# Altium schematic sheet wireframe_sch.SchDoc
size A3; PageSetup: Record=PageOptions|CenterHorizontal=True|CenterVertical=True|PrintScale=0.70|XCorrection=1.00|YCorrection=1.00|PrintKind=0|BorderSize=5000000|LeftOffset=0|BottomOffset=0|Orientation=2|PaperLength=1000|PaperWidth=1000|Scale=100|PaperSource=7|PrintQuality=-4|MediaType=1|DitherType=10|PaperKind=A4|PrintScaleMode=0
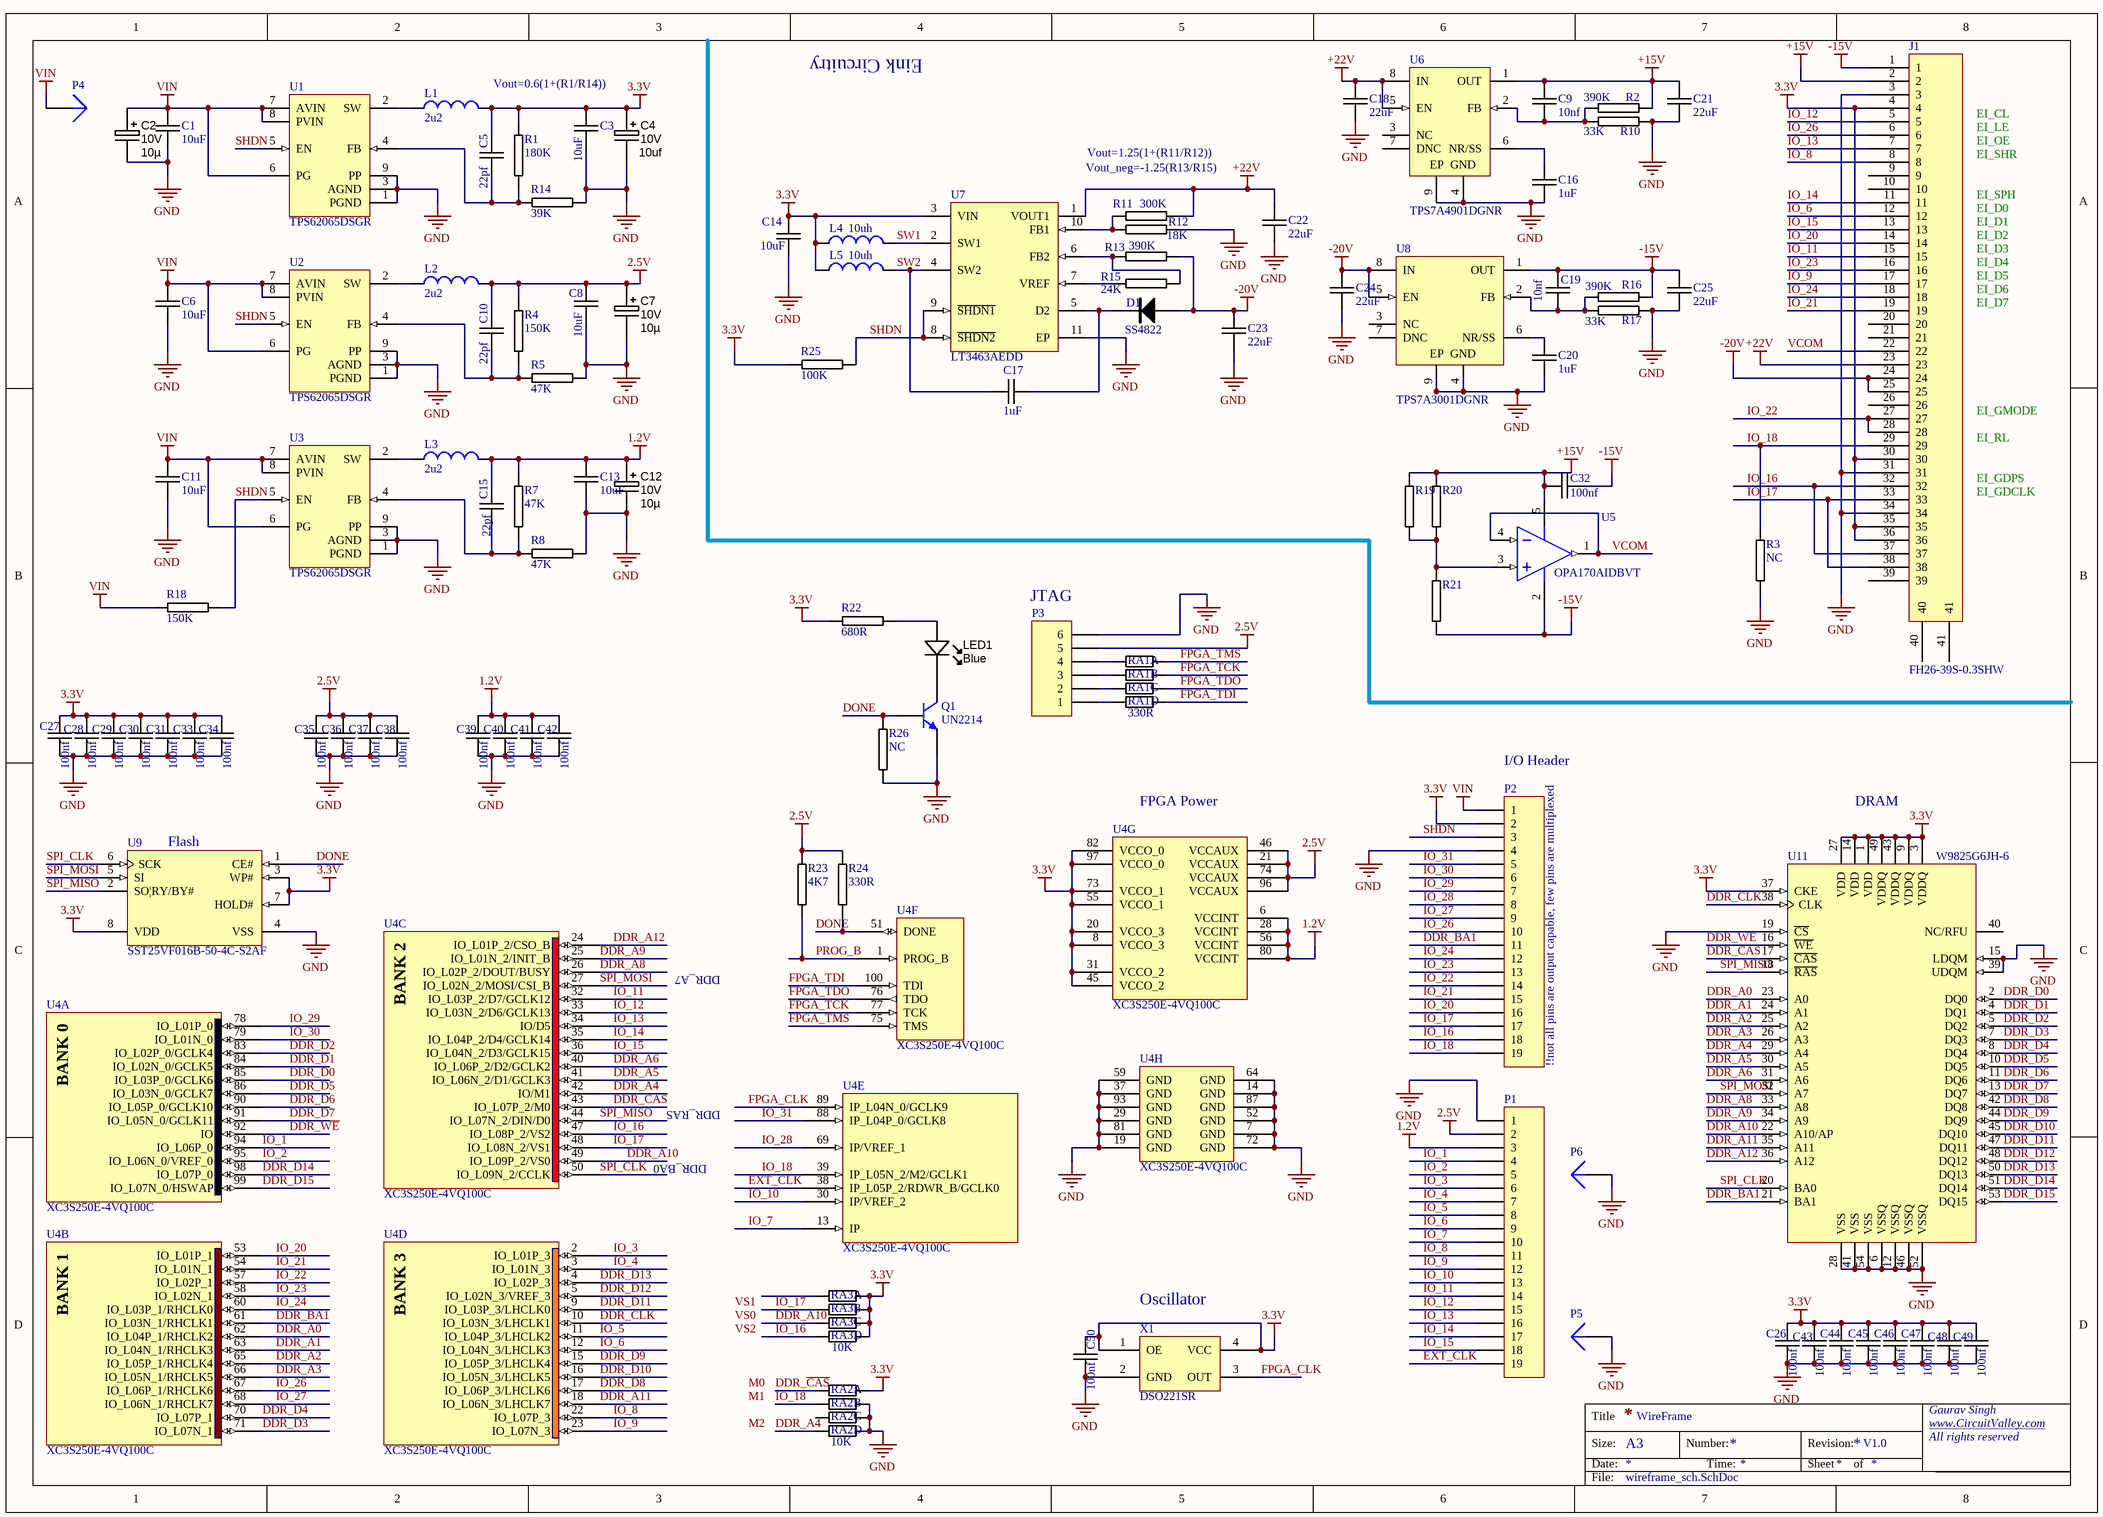
[diagram p0: wireframe_sch.SchDoc]

## Parts
C1  10uF  [0603C-GENERIC]
C2  Ratings: 10V  [CAPMP3528X210N]  (hidden comment: 10µ)
C3  10uF  [0603C-GENERIC]
C4  10uf  Ratings: 10V  [CAPMP3528X210N]
C5  22pf  [0603C-GENERIC]
C6  10uF  [0603C-GENERIC]
C7  Ratings: 10V  [CAPMP3528X210N]  (hidden comment: 10µ)
C8  10uF  [0603C-GENERIC]
C9  10nf  [0603C-GENERIC]
C10  22pf  [0603C-GENERIC]
C11  10uF  [0603C-GENERIC]
C12  Ratings: 10V  [CAPMP3528X210N]  (hidden comment: 10µ)
C13  10uF  [0603C-GENERIC]
C14  10uF  [0603C-GENERIC]
C15  22pf  [0603C-GENERIC]
C16  1uF  [0603C-GENERIC]
C17  1uF  [0603C-GENERIC]
C18  22uF  [0603C-GENERIC]
C19  10nf  [0603C-GENERIC]
C20  1uF  [0603C-GENERIC]
C21  22uF  [0603C-GENERIC]
C22  22uF  [0603C-GENERIC]
C23  22uF  [0603C-GENERIC]
C24  22uF  [0603C-GENERIC]
C25  22uF  [0603C-GENERIC]
C26  100nf  [0603C-GENERIC]
C27  100nf  [0603C-GENERIC]
C28  100nf  [0603C-GENERIC]
C29  100nf  [0603C-GENERIC]
C30  100nf  [0603C-GENERIC]
C31  100nf  [0603C-GENERIC]
C32  100nf  [0603C-GENERIC]
C33  100nf  [0603C-GENERIC]
C34  100nf  [0603C-GENERIC]
C35  100nf  [0603C-GENERIC]
C36  100nf  [0603C-GENERIC]
C37  100nf  [0603C-GENERIC]
C38  100nf  [0603C-GENERIC]
C39  100nf  [0603C-GENERIC]
C40  100nf  [0603C-GENERIC]
C41  100nf  [0603C-GENERIC]
C42  100nf  [0603C-GENERIC]
C43  100nf  [0603C-GENERIC]
C44  100nf  [0603C-GENERIC]
C45  100nf  [0603C-GENERIC]
C46  100nf  [0603C-GENERIC]
C47  100nf  [0603C-GENERIC]
C48  100nf  [0603C-GENERIC]
C49  100nf  [0603C-GENERIC]
C50  100nf  [0603C-GENERIC]
D1  SS4822  [DIODE-SMA]
J1  FH26-39S-0.3SHW  [FH26-39S-0.3SHW]
L1  2u2  [TAIYO_NRS4018T2R2MDGJ]
L2  2u2  [TAIYO_NRS4018T2R2MDGJ]
L3  2u2  [TAIYO_NRS4018T2R2MDGJ]
L4  10uh  [IFSC-1515AH-01]
L5  10uh  [IFSC-1515AH-01]
LED1  Blue  [LED-0805-K]
P1  Header 19  [HDR1X19]  (value not drawn)
P2  Header 19  [HDR1X19]  (value not drawn)
P3  Header 6  [HDR1X6]  (value not drawn)
P4  Plug  [PIN1]  (value not drawn)
P5  Plug  [PIN1]  (value not drawn)
P6  Plug  [PIN1]  (value not drawn)
Q1  UN2214  [SOT23_N]
R1  180K  [0603R-2K2]
R2  390K  [0603R-2K2]
R3  NC  [0402R-GENERIC]
R4  150K  [0603R-2K2]
R5  47K  [0603R-2K2]
R7  47K  [0603R-2K2]
R8  47K  [0603R-2K2]
R10  33K  [0603R-2K2]
R11  300K  [0603R-2K2]
R12  18K  [0603R-2K2]
R13  390K  [0603R-2K2]
R14  39K  [0603R-2K2]
R15  24K  [0603R-2K2]
R16  390K  [0603R-2K2]
R17  33K  [0603R-2K2]
R18  150K  [0603R-2K2]
R19  unknown  [0603R-2K2]  (value not drawn)
R20  unknown  [0603R-2K2]  (value not drawn)
R21  unknown  [0603R-2K2]  (value not drawn)
R22  680R  [0603R-2K2]
R23  4K7  [0603R-2K2]
R24  330R  [0603R-2K2]
R25  100K  [0603R-2K2]
R26  NC  [0402R-GENERIC]
RA1  Thick Film  [EXV28V]  (value not drawn)  (parts A,B,C,D of 4)
RA2  10K  [EXV28V]  (parts A,B,C,D of 4)
RA3  Thick Film  [EXV28V]  (value not drawn)  (parts A,B,C,D of 4)
U1  TPS62065DSGR  [DSG8-1600X900TP]
U2  TPS62065DSGR  [DSG8-1600X900TP]
U3  TPS62065DSGR  [DSG8-1600X900TP]
U4  XC3S250E-4VQ100C  [VQ100_N]  (parts A,B,C,D,E,F,G,H of 8)
U5  OPA170AIDBVT  [TI-DBV5_N]
U6  TPS7A4901DGNR  [TI-DGN8-1760X1425TP_N]
U7  LT3463AEDD  [LT-DD-10_V]
U8  TPS7A3001DGNR  [TI-DGN8-1760X1425TP_N]
U9  SST25VF016B-50-4C-S2AF  [MCHP-SOIC-S2A8_N]
U11  W9825G6JH-6  [54_TSOP2_400AF_N]
X1  DSO221SR  [Active Oscillator 2520]

## Nets
1.2V: C12.1 C13.2 C15.2 C39.2 C40.2 C41.2 C42.2 L3.2 P1.3 R7.2 U4.6(VCCINT) U4.28(VCCINT) U4.56(VCCINT) U4.80(VCCINT)
2.5V: C7.1 C8.2 C10.2 C35.2 C36.2 C37.2 C38.2 L2.2 P1.2 P3.5 R4.2 R23.2 R24.2 U4.21(VCCAUX) U4.46(VCCAUX) U4.74(VCCAUX) U4.96(VCCAUX)
3.3V: C3.2 C4.1 C5.2 C14.2 C26.2 C27.2 C28.2 C29.2 C30.2 C31.2 C33.2 C34.2 C43.2 C44.2 C45.2 C46.2 C47.2 C48.2 C49.2 C50.2 J1.4 J1.30 J1.35 J1.36 L1.2 L4.1 L5.1 P2.2 R1.2 R22.2 R25.2 RA2.1 RA3.1 RA3.2 RA3.3 RA3.4 U4.8(VCCO_3) U4.20(VCCO_3) U4.31(VCCO_2) U4.45(VCCO_2) U4.55(VCCO_1) U4.73(VCCO_1) U4.82(VCCO_0) U4.97(VCCO_0) U7.3(VIN) U9.3(WP#) U9.7(HOLD#) U9.8(VDD) U11.1(VDD) U11.3(VDDQ) U11.9(VDDQ) U11.14(VDD) U11.27(VDD) U11.37(CKE) U11.43(VDDQ) U11.49(VDDQ) X1.1(OE) X1.4(VCC)
+15V: C9.1 C21.2 C32.2 J1.2 R2.2 R19.2 R20.2 U5.5(V+) U6.1(OUT)
+22V: C18.2 C22.2 J1.23 R11.2 U6.5(EN) U6.8(IN) U7.1(VOUT1)
-15V: C19.1 C25.2 C32.1 J1.1 R16.2 R21.1 U5.2(V-) U8.1(OUT)
-20V: C23.2 C24.2 D1.A J1.24 J1.25 R13.2 U8.5(EN) U8.8(IN)
GND: C1.1 C2.2 C3.1 C4.2 C6.1 C7.2 C8.1 C11.1 C12.2 C13.1 C14.1 C16.1 C18.1 C20.2 C21.1 C22.1 C23.1 C24.1 C25.1 C26.1 C27.1 C28.1 C29.1 C30.1 C31.1 C33.1 C34.1 C35.1 C36.1 C37.1 C38.1 C39.1 C40.1 C41.1 C42.1 C43.1 C44.1 C45.1 C46.1 C47.1 C48.1 C49.1 C50.1 J1.3 J1.31 J1.34 P1.1 P2.4 P3.6 P5.1 P6.1 Q1.2(E) R3.2 R5.1 R8.1 R10.2 R12.1 R14.1 R17.2 R26.2 RA2.2 RA2.3 RA2.4 U1.1(PGND) U1.3(AGND) U1.9(PP) U2.1(PGND) U2.3(AGND) U2.9(PP) U3.1(PGND) U3.3(AGND) U3.9(PP) U4.7(GND) U4.14(GND) U4.19(GND) U4.29(GND) U4.37(GND) U4.52(GND) U4.59(GND) U4.64(GND) U4.72(GND) U4.81(GND) U4.87(GND) U4.93(GND) U6.4(GND) U6.9(EP) U7.11(EP) U8.4(GND) U8.9(EP) U9.4(VSS) U11.6(VSSQ) U11.12(VSSQ) U11.15(LDQM) U11.19(~{CS}) U11.28(VSS) U11.39(UDQM) U11.41(VSS) U11.46(VSSQ) U11.52(VSSQ) U11.54(VSS) X1.2(GND)
VIN: C1.2 C2.1 C6.2 C11.2 P2.1 P4.1 R18.2 U1.6(PG) U1.7(AVIN) U1.8(PVIN) U2.6(PG) U2.7(AVIN) U2.8(PVIN) U3.6(PG) U3.7(AVIN) U3.8(PVIN)
DDR_A0: U4.62(IO_L04P_1/RHCLK2) U11.23(A0)
DDR_A1: U4.63(IO_L04N_1/RHCLK3) U11.24(A1)
DDR_A2: U4.65(IO_L05P_1/RHCLK4) U11.25(A2)
DDR_A3: U4.66(IO_L05N_1/RHCLK5) U11.26(A3)
DDR_A4: RA2.5 U4.42(IO/M1) U11.29(A4)
DDR_A5: U4.41(IO_L06N_2/D1/GCLK3) U11.30(A5)
DDR_A6: U4.40(IO_L06P_2/D2/GCLK2) U11.31(A6)
DDR_A8: U4.26(IO_L02P_2/DOUT/BUSY) U11.33(A8)
DDR_A9: U4.25(IO_L01N_2/INIT_B) U11.34(A9)
DDR_A10: RA3.6 U4.49(IO_L09P_2/VS0) U11.22(A10/AP)
DDR_A11: U4.18(IO_L06N_3/LHCLK7) U11.35(A11)
DDR_A12: U4.24(IO_L01P_2/CSO_B) U11.36(A12)
DDR_BA1: P2.11 U4.61(IO_L03N_1/RHCLK1) U11.21(BA1)
DDR_~{CAS}: RA2.8 U4.43(IO_L07P_2/M0) U11.17(~{CAS})
DDR_CLK: U4.10(IO_L03N_3/LHCLK1) U11.38(CLK)
DDR_D0: U4.85(IO_L03P_0/GCLK6) U11.2(DQ0)
DDR_D1: U4.84(IO_L02N_0/GCLK5) U11.4(DQ1)
DDR_D2: U4.83(IO_L02P_0/GCLK4) U11.5(DQ2)
DDR_D3: U4.71(IO_L07N_1) U11.7(DQ3)
DDR_D4: U4.70(IO_L07P_1) U11.8(DQ4)
DDR_D5: U4.86(IO_L03N_0/GCLK7) U11.10(DQ5)
DDR_D6: U4.90(IO_L05P_0/GCLK10) U11.11(DQ6)
DDR_D7: U4.91(IO_L05N_0/GCLK11) U11.13(DQ7)
DDR_D8: U4.17(IO_L06P_3/LHCLK6) U11.42(DQ8)
DDR_D9: U4.15(IO_L05P_3/LHCLK4) U11.44(DQ9)
DDR_D10: U4.16(IO_L05N_3/LHCLK5) U11.45(DQ10)
DDR_D11: U4.9(IO_L03P_3/LHCLK0) U11.47(DQ11)
DDR_D12: U4.5(IO_L02N_3/VREF_3) U11.48(DQ12)
DDR_D13: U4.4(IO_L02P_3) U11.50(DQ13)
DDR_D14: U4.98(IO_L07P_0) U11.51(DQ14)
DDR_D15: U4.99(IO_L07N_0/HSWAP) U11.53(DQ15)
DDR_~{WE}: U4.92(IO) U11.16(~{WE})
DONE: Q1.1(B) R24.1 R26.1 U4.51(DONE) U9.1(CE#)
EXT_CLK: P1.19 U4.38(IP_L05P_2/RDWR_B/GCLK0)
FPGA_CLK: U4.89(IP_L04N_0/GCLK9) X1.3(OUT)
FPGA_TCK: RA1.2 U4.77(TCK)
FPGA_TDI: RA1.4 U4.100(TDI)
FPGA_TDO: RA1.3 U4.76(TDO)
FPGA_TMS: RA1.1 U4.75(TMS)
IO_1: P1.4 U4.94(IO_L06P_0)
IO_2: P1.5 U4.95(IO_L06N_0/VREF_0)
IO_3: P1.6 U4.2(IO_L01P_3)
IO_4: P1.7 U4.3(IO_L01N_3)
IO_5: P1.8 U4.11(IO_L04P_3/LHCLK2)
IO_6: J1.12 P1.9 U4.12(IO_L04N_3/LHCLK3)
IO_7: P1.10 U4.13(IP)
IO_8: J1.8 P1.11 U4.22(IO_L07P_3)
IO_9: J1.17 P1.12 U4.23(IO_L07N_3)
IO_10: P1.13 U4.30(IP/VREF_2)
IO_11: J1.15 P1.14 U4.32(IO_L03P_2/D7/GCLK12)
IO_12: J1.5 P1.15 U4.33(IO_L03N_2/D6/GCLK13)
IO_13: J1.7 P1.16 U4.34(IO/D5)
IO_14: J1.11 P1.17 U4.35(IO_L04P_2/D4/GCLK14)
IO_15: J1.13 P1.18 U4.36(IO_L04N_2/D3/GCLK15)
IO_16: J1.32 J1.37 P2.18 RA3.5 U4.47(IO_L08P_2/VS2)
IO_17: J1.33 J1.38 P2.17 RA3.7 U4.48(IO_L08N_2/VS1)
IO_18: J1.29 P2.19 R3.1 RA2.7 U4.39(IP_L05N_2/M2/GCLK1)
IO_20: J1.14 P2.16 U4.53(IO_L01P_1)
IO_21: J1.19 P2.15 U4.54(IO_L01N_1)
IO_22: J1.27 J1.28 P2.14 U4.57(IO_L02P_1)
IO_23: J1.16 P2.13 U4.58(IO_L02N_1)
IO_24: J1.18 P2.12 U4.60(IO_L03P_1/RHCLK0)
IO_26: J1.6 P2.10 U4.67(IO_L06P_1/RHCLK6)
IO_27: P2.9 U4.68(IO_L06N_1/RHCLK7)
IO_28: P2.8 U4.69(IP/VREF_1)
IO_29: P2.7 U4.78(IO_L01P_0)
IO_30: P2.6 U4.79(IO_L01N_0)
IO_31: P2.5 U4.88(IP_L04P_0/GCLK8)
PROG_B: R23.1 U4.1(PROG_B)
SHDN: P2.3 R18.1 R25.1 U1.5(EN) U2.5(EN) U3.5(EN) U7.8(~{SHDN2}) U7.9(~{SHDN1})
SPI_CLK: U4.50(IO_L09N_2/CCLK) U9.6(SCK) U11.20(BA0)
SPI_MISO: U4.44(IO_L07N_2/DIN/D0) U9.2(SO|RY/BY#) U11.18(~{RAS})
SPI_MOSI: U4.27(IO_L02N_2/MOSI/CSI_B) U9.5(SI) U11.32(A7)
SW1: L4.2 U7.2(SW1)
SW2: C17.2 L5.2 U7.4(SW2)
VCOM: J1.22 U5.1(OUT) U5.4(IN-)
NetC5_1: C5.1 R1.1 R14.2 U1.4(FB)
NetC9_2: C9.2 R2.1 R10.1 U6.2(FB)
NetC10_1: C10.1 R4.1 R5.2 U2.4(FB)
NetC15_1: C15.1 R7.1 R8.2 U3.4(FB)
NetC16_2: C16.2 U6.6(NR/SS)
NetC17_1: C17.1 D1.K U7.5(D2)
NetC19_2: C19.2 R16.1 R17.1 U8.2(FB)
NetC20_1: C20.1 U8.6(NR/SS)
NetL1_1: L1.1 U1.2(SW)
NetL2_1: L2.1 U2.2(SW)
NetL3_1: L3.1 U3.2(SW)
NetLED1_A: LED1.A R22.1
NetLED1_K: LED1.K Q1.3(C)
NetP3_1: P3.1 RA1.5
NetP3_2: P3.2 RA1.6
NetP3_3: P3.3 RA1.7
NetP3_4: P3.4 RA1.8
NetR11_1: R11.1 R12.2 U7.10(FB1)
NetR13_1: R13.1 R15.2 U7.6(FB2)
NetR15_1: R15.1 U7.7(VREF)
NetR19_1: R19.1 R20.1 R21.2 U5.3(IN+)

Not connected (* = marked no-connect by the designer): J1 9 10 20 21 26 39 40 41; RA2 6; RA3 8; U6 3(NC) 7(DNC); U8 3(NC) 7(DNC); U11 40(NC/RFU)

## Notes on the sheet
- Eink Circuitry
- Vout=0.6(1+(R1/R14))
- Vout_neg=-1.25(R13/R15)
- Vout=1.25(1+(R11/R12))
- (near P3) JTAG
- (near P2) I/O Header
- (near U9) Flash
- (near U4) FPGA Power
- DRAM
- DDR_A7
- (near P2) !!not all pins are output capable, few pins are multiplexed
- DDR_RAS
- DDR_BA0
- (near X1) Oscillator
- WireFrame
- V1.0
- Labels drawn without touching a wire or pin: EI_CL, EI_D0, EI_D1, EI_D2, EI_D3, EI_D4, EI_D5, EI_D6, EI_D7, EI_GDCLK, EI_GDPS, EI_GMODE, EI_LE, EI_OE, EI_RL, EI_SHR, EI_SPH, M0, M1, M2, VS0, VS1, VS2
- Title
- Size:
- Date:
- A3
- Number:
- Time:
- Revision:
- Sheet
- of
- Gaurav Singh
- www.CircuitValley.com
- All rights reserved
- File:
- (in symbol XC3S250E-4VQ100C, part A) BANK 0
- (in symbol XC3S250E-4VQ100C, part B) BANK 1
- (in symbol XC3S250E-4VQ100C, part C) BANK 2
- (in symbol XC3S250E-4VQ100C, part D) BANK 3

## Library data of the parts
C1 C3 C5 C6 C8-C11 C13-C50 = 0603C-10UF-6V3-X5R-MUR: CAPACITOR 0603 CERAMIC; Manufacturer: Murata Electronics North America; Manufacturer Part Number: GRM188R60J106ME47D; Reel: C24; Supplier 1: Digi-Key; Supplier Part Number 1: 490-3896-2-ND
C2 C12 = CAPT_47u_1210_6V3: Capacitor SMD Tantalum 47uF 20% 6.3V 1210; Manufacturer 1: AVX Corporation; Manufacturer Part Number 1: TCJB476M006R0070; Manufacturer Size Code: B; ESR (Equivalent Series Resistance): 70.0 mOhm; Type: Molded; Package / Case: 1210 (3528 Metric); Tolerance: ±20%; Material: Tantalum; Supplier 1: Digi-Key; Supplier Part Number 1: 478-3139-1-ND; Voltage - Rated: 10V; Operating Temperature: -55°C ~ 125°C; Size / Dimension: 0.138" L x 0.110" W (3.50mm x 2.80mm); Height - Seated (Max): 0.083" (2.10mm); ComponentLink1URL: http://www.avx.com/docs/Catalogs/tcj.pdf; ComponentLink1Description: http://www.avx.com/docs/Catalogs/tcj.pdf; Value: 10µ
C4 = CAPT_47u_1210_6V3: Capacitor SMD Tantalum 47uF 20% 6.3V 1210; Manufacturer 1: AVX Corporation; Manufacturer Part Number 1: TCJB476M006R0070; Manufacturer Size Code: B; ESR (Equivalent Series Resistance): 70.0 mOhm; Type: Molded; Value: 47µ; Package / Case: 1210 (3528 Metric); Tolerance: ±20%; Material: Tantalum; Supplier 1: Digi-Key; Supplier Part Number 1: 478-3139-1-ND; Voltage - Rated: 10V; Operating Temperature: -55°C ~ 125°C; Size / Dimension: 0.138" L x 0.110" W (3.50mm x 2.80mm); Height - Seated (Max): 0.083" (2.10mm); ComponentLink1URL: http://www.avx.com/docs/Catalogs/tcj.pdf; ComponentLink1Description: http://www.avx.com/docs/Catalogs/tcj.pdf
C7 = CAPT_47u_1210_6V3: Capacitor SMD Tantalum 47uF 20% 6.3V 1210; Manufacturer 1: AVX Corporation; Manufacturer Part Number 1: TCJB476M006R0070; Manufacturer Size Code: B; Voltage - Rated: 6V3; ESR (Equivalent Series Resistance): 70.0 mOhm; Type: Molded; Package / Case: 1210 (3528 Metric); Tolerance: ±20%; Material: Tantalum; Supplier 1: Digi-Key; Supplier Part Number 1: 478-3139-1-ND; Operating Temperature: -55°C ~ 125°C; Size / Dimension: 0.138" L x 0.110" W (3.50mm x 2.80mm); Height - Seated (Max): 0.083" (2.10mm); ComponentLink1URL: http://www.avx.com/docs/Catalogs/tcj.pdf; ComponentLink1Description: http://www.avx.com/docs/Catalogs/tcj.pdf; Value: 10µ
D1 = MBRS140: DIODE; Supplier 1: Digi-Key; Supplier Part Number 1: MBRS140FSTR-ND
L1-L3 = inductor_smd: PartNumber: NRS4018T2R2MDGJ
L4 L5 = inductor_smd: PartNumber: IFSC1515AHER100M01
LED1 = LED_SMD_Blue_0805_100mcd: LED 0805 SMD Blue 100mcd 470nm; Manufacturer 1: Ligitek; Manufacturer Part Number 1: LG-170DBKZ-CT; Material: InGaN/GaN; Ratings: 100 mcd; 470 nm; Package / Case: 0805; Value: Blue; Color: Blue
P1 P2 = Header 19: Header, 19-Pin; LatestRevisionDate: 17-Jul-2002; LatestRevisionNote: Re-released for DXP Platform.; Publisher: Altium Limited
P3 = Header 6: Header, 6-Pin; LatestRevisionDate: 17-Jul-2002; LatestRevisionNote: Re-released for DXP Platform.; Publisher: Altium Limited
Q1 = BC847: NPN General-purpose Transistor; Published: 17-Sep-2003; LatestRevisionDate: 12-Dec-2006; LatestRevisionNote: IPC-7351 Footprint Added.; DatasheetVersion: 4-Feb-2002; PackageVersion: May-1999; PackageReference: SOT23; Publisher: Altium Limited; PackageDescription: 3-Pin SOT-23 Package 0.95 mm Pitch, 2.3 mm Lead Span; ComponentLink1Description: Manufacturer Link; ComponentLink1URL: http://www.semiconductors.philips.com/; ComponentLink2Description: Datasheet; ComponentLink2URL: http://www.semiconductors.philips.com/acrobat/datasheets/BC846_BC847_BC848_5.pdf
R1 R2 R4 R5 R7 R8 R10-R25 = 0603R-2K2: GENERIC RESISTOR 0603; Manufacturer Part Number: RMC 1/16 2.2K 1% R; Manufacturer: Stackpole Electronics Inc; REEL: R88; Supplier 1: Digi-Key; Supplier Part Number 1: RMCF0603FT2K20TR-ND
R3 R26 = 0402R-100R: RESISTOR 0402 GENERIC
RA1-RA3 = RES_ARRAY_0402_5%: Resistor array 4-pack 5% 0402 SMD
U1-U3 = TPS62067DSGR: Buck Step Down Regulator with 2.9 to 6 V Input and 0.8 to 6 V Output, -40 to 85 degC, 8-Pin WSON (DSG), Green (RoHS & no Sb/Br); Manufacturer: Texas Instruments; Duty Cycle(Max)(%): 100; Iout(Max)(A): 2; Iq(Typ)(mA): 0.018; Rating: Catalog; Regulated Outputs(#): 1; SubFamily: Step-Down Regulator; Switch Current Limit(Typ)(A): 2.75; Synchronous Rectification: TRUE; Vin(Max)(V): 6; Vin(Min)(V): 2.9; Vout(Min)(V): 0.8; DatasheetVersion: SLVS833A; PackageVersion: revB, Oct-2010; PackageReference: DSG8-1600X900TP; PackageDescription: 8-Pin Plastic Small Outline No-Lead, 2 x 2 x 0.8 mm Body, 0.5 mm Pitch, Exposed Pad; Supplier 1: Digi-Key; Supplier Part Number 1: TPS62067DSGR-ND; Supplier 2: Newark; Supplier Part Number 2: 72R6655; Supplier 3: Mouser; Supplier Part Number 3: 595-TPS62067DSGR; Eco-Plan: Green (RoHS & no Sb/Br); Topology: Buck; Vout(Max)(V): 6; Mounting Technology: Surface Mount; Code_JEDEC: MO-229; PartNumber: TPS62067DSGR; ComponentLink1Description: Datasheet; ComponentLink1URL: http://www.ti.com/general/docs/lit/getliterature.tsp?genericPartNumber=TPS62067&fileType=pdf; ComponentLink2Description: Package Specification; ComponentLink2URL: http://www.ti.com/litv/pdf/mpds308a; ComponentLink3Description: URL Link1; ComponentLink3URL: Samples URL:http://www.ti.com/product/tps62067#samples
U4 = XC3S250E-4VQ100C: Spartan-3E 1.2V FPGA, 66 User I/Os, 100-Pin VQFP, Standard Performance, Commercial Grade; DatasheetVersion: ver3.8, Aug-2009; PackageVersion: ver1.2.1, Feb-2007; PackageReference: VQ100; PackageDescription: 100-Pin Very Thin Quad Flat Pack (VQ100); Code_JEDEC: MS-026-AED; ComponentLink1Description: Manufacturer URL; ComponentLink1URL: http://www.xilinx.com/; ComponentLink2Description: Spartan-3E Datasheet; ComponentLink2URL: http://www.xilinx.com/support/documentation/data_sheets/ds312.pdf; ComponentLink3Description: VQ100 Package Drawing; ComponentLink3URL: http://www.xilinx.com/support/documentation/package_specs/vq100.pdf; ComponentLink4Description: Spartan-3E Documents; ComponentLink4URL: http://www.xilinx.com/support/documentation/spartan-3e.htm
U5 = OPA244NA/250: MicroPower Single-Supply Operational Amplifier MicroAmplifier(TM) Series, 2.2 to 36 V, -40 to 85 degC, 5-pin SOT23 (DBV5), Green (RoHS & no Sb/Br); Manufacturer: Texas Instruments; CMRR(Min)(dB): 84; GBW(Typ)(MHz): 0.43; IIB(Max)(pA): 25000; Iq per channel(Max)(mA): 0.06; Number of Channels: 1; Offset Drift(Typ)(uV/C): 4; Packing: SMALL T&R; Rating: Catalog; Slew Rate(Typ)(V/us): 0.1; Sub Family: High Supply Voltage Amplifier (>=30V), Low Power Amp (<=500uA), Low Supply Voltage Amplifier (<=2.7V), Precision Amplifier; Total Supply Voltage(Max)(+5V is 5, +/-5V is 10): 36; Total Supply Voltage(Min)(+5V is 5, +/-5V is 10): 2.2; Vio (25C)(Max)(mV): 1.5; DatasheetVersion: SBOS088; PackageVersion: 4073253-4/K, 03/2006; PackageReference: DBV5; PackageDescription: 5-Pin Plastic Small Outline, Body 1.6 x 2.9 mm, Pitch 0.95 mm; Supplier 1: Digi-Key; Supplier Part Number 1: OPA244NATR-ND; Supplier 2: Digi-Key; Supplier Part Number 2: OPA244NACT-ND; Supplier 3: Digi-Key; Supplier Part Number 3: OPA244NADKR-ND; Supplier 4: Farnell; Supplier Part Number 4: 4413477; Supplier 5: Newark; Supplier Part Number 5: 35C1876; Supplier 6: Mouser; Supplier Part Number 6: 595-OPA244NA/250; Eco-Plan: Green (RoHS & no Sb/Br); Mounting Technology: Surface Mount; Code_JEDEC: MO-178; PartNumber: OPA170AIDBVT; ComponentLink1Description: Manufacturer URL; ComponentLink1URL: http://www.ti.com/; ComponentLink2Description: Datasheet; ComponentLink2URL: http://www.ti.com/lit/ds/symlink/opa244.pdf; ComponentLink3Description: Package Specification; ComponentLink3URL: http://www.ti.com/litv/pdf/mpds018i
U6 = TPS7A4901DGNR: Single Output High PSRR LDO, 150 mA, Adjustable 1.2 to 33 V Output, 3 to 36 V Input, with Ultra-Low Noise, 8-pin MSOP (DGN), -40 to 125 degC, Green (RoHS & no Sb/Br); Manufacturer: Texas Instruments; Accuracy(%): 1.5; Iout(Max)(A): 0.15; Iq(Typ)(mA): 0.06; Power Good: TRUE; SubFamily: Single Channel LDO; Vdo(Typ)(mV): 260; Vin(Max)(V): 36; Vin(Min)(V): 3; Vout Adj(Max)(V): 33; Vout Adj(Min)(V): 1.2; DatasheetVersion: SBVS121B; PackageVersion: 4073271/F; PackageReference: DGN8-1760X1425TP; PackageDescription: 8-pin Plastic Small Outline, Body 3 x 3 mm, Pitch 0.65 mm; Supplier 1: Digi-Key; Supplier Part Number 1: 296-27751-2-ND; Supplier 2: Digi-Key; Supplier Part Number 2: 296-27751-1-ND; Supplier 3: Digi-Key; Supplier Part Number 3: 296-27751-6-ND; Supplier 4: Newark; Supplier Part Number 4: 01T0879; Supplier 5: Mouser; Supplier Part Number 5: 595-TPS7A4901DGNR; Eco-Plan: Green (RoHS & no Sb/Br); Mounting Technology: Surface Mount; Code_JEDEC: MO-187; PartNumber: TPS7A4901DGNR; ComponentLink1Description: Manufacturer URL; ComponentLink1URL: http://www.ti.com/; ComponentLink2Description: Datasheet; ComponentLink2URL: http://www.ti.com/general/docs/lit/getliterature.tsp?genericPartNumber=TPS7A4901&fileType=pdf; ComponentLink3Description: Package Specification; ComponentLink3URL: http://www.ti.com/litv/pdf/mpds046e
U7 = LT3463AEDD: Dual Micropower DC/DC Converters with Schottky Diodes, 2.4 to 15 V Vin, 10-pin SON (DD-10), -40 to 85 degC; Manufacturer: Linear Technology; Number of Outputs: 2; Vin Max(V): 15; Vin Min(V): 2.4; PackageVersion: Rev. C, 06/2010; PackageReference: DD-10; PackageDescription: 10-Pin Plastic DFN, Body 3 x 3 mm, Pitch 0.5 mm; Supplier 1: Digi-Key; Supplier Part Number 1: LT3463AEDD-ND; RoHS: FALSE; Mounting Technology: Surface Mount; Code_JEDEC: MO-229; PartNumber: LT3463AEDD; ComponentLink1Description: Manufacturer URL; ComponentLink1URL: http://www.linear.com/; ComponentLink2Description: Datasheet; ComponentLink2URL: http://cds.linear.com/docs/en/datasheet/3463f.pdf; ComponentLink3Description: Package Specification; ComponentLink3URL: http://cds.linear.com/docs/en/packaging/DFN_10_05-08-1699.pdf
U8 = TPS7A3001DGNR: Single Output High PSRR LDO, 200 mA, Adjustable -1.18 to -33 V Output, -3 to -36 V Input, with Ultra-Low Noise, 8-pin MSOP (DGN), -40 to 125 degC, Green (RoHS & no Sb/Br); Manufacturer: Texas Instruments; Accuracy(%): 1.5; Iout(Max)(A): 0.2; Iq(Typ)(mA): 0.05; SubFamily: Single Channel LDO; Vdo(Typ)(mV): 216; DatasheetVersion: SBVS125A; PackageVersion: 4073271/F; PackageReference: DGN8-1760X1425TP; PackageDescription: 8-pin Plastic Small Outline, Body 3 x 3 mm, Pitch 0.65 mm; Supplier 1: Digi-Key; Supplier Part Number 1: 296-27750-2-ND; Supplier 2: Digi-Key; Supplier Part Number 2: 296-27750-1-ND; Supplier 3: Digi-Key; Supplier Part Number 3: 296-27750-6-ND; Supplier 4: Newark; Supplier Part Number 4: 01T0878; Supplier 5: Mouser; Supplier Part Number 5: 595-TPS7A3001DGNR; Eco-Plan: Green (RoHS & no Sb/Br); Vin(Max)(V): -36; Vin(Min)(V): -3; Vout Adj(Max)(V): -33; Vout Adj(Min)(V): -1.18; Mounting Technology: Surface Mount; Code_JEDEC: MO-187; PartNumber: TPS7A3001DGNR; ComponentLink1Description: Manufacturer URL; ComponentLink1URL: http://www.ti.com/; ComponentLink2Description: Datasheet; ComponentLink2URL: http://www.ti.com/general/docs/lit/getliterature.tsp?genericPartNumber=TPS7A3001&fileType=pdf; ComponentLink3Description: Package Specification; ComponentLink3URL: http://www.ti.com/litv/pdf/mpds046e
U9 = SST25VF016B-50-4C-S2AF: 16 Mbit SPI Serial Flash, 2.7 to 3.6 V, 50 MHz, 0 to 70 degC, 8-pin SOIC (S2A8), Tube; Manufacturer: Microchip; DatasheetVersion: Rev. A; PackageVersion: Rev. A; PackageReference: SOIC-S2A8; PackageDescription: 8-Lead Plastic Small Outline Intergrated Circuit, 5.275 x 5.275 mm Body, 1.27 mm Pitch; Supplier 1: Digi-Key; Supplier Part Number 1: SST25VF016B-50-4C-S2AF-ND; Supplier 2: Newark; Supplier Part Number 2: 82R4467; Supplier 3: Mouser; Supplier Part Number 3: 579-25VF016B504CS2AF; Mounting Technology: Surface Mount; PartNumber: SST25VF016B-50-4C-S2AF; ComponentLink1Description: Manufacturer URL; ComponentLink1URL: http://www.microchip.com; ComponentLink2Description: Datasheet; ComponentLink2URL: http://ww1.microchip.com/downloads/en/DeviceDoc/25044A.pdf; ComponentLink3Description: Package Specification; ComponentLink3URL: http://ww1.microchip.com/downloads/en/DeviceDoc/25051A.pdf; ComponentLink4Description: Product URL; ComponentLink4URL: http://www.microchip.com/SST25VF016B
U11 = K4S511632B-TC75: 512Mb Synchronous High Data Rate DRAM, 8Mb x 16Bit x 4 Banks, 54-Pin TSOP; Frequency: 133MHz (max); RowAddress: A0-A12; ColumnAddress: A0-A9; Published: 11-Oct-2004; LatestRevisionDate: 13-Apr-2006; LatestRevisionNote: IPC-7351 Footprint Added.; DatasheetVersion: rev1.1, Feb-2004; PackageVersion: Aug-2004; PackageReference: 54_TSOP2_400AF; Publisher: Altium Limited; PackageDescription: 54-Pin Small Outline Package 0.8 mm Pitch; ComponentLink1Description: Manufacturer Link; ComponentLink1URL: http://www.samsung.com; ComponentLink2Description: Datasheet; ComponentLink2URL: http://www.samsung.com/Products/Semiconductor/DRAM/SDRAM/SDRAMcomponent/512Mbit/K4S510432B/ds_sdr_512mb_b-die_x4x8x16_11.pdf
X1 = Oscillator_2520: Active Oscillator_2520
P4-P6 = Plug: LatestRevisionDate: 17-Jul-2002; LatestRevisionNote: Re-released for DXP Platform.; Publisher: Altium Limited